# EAGLE design esp32_ornith_1.0.2 (EAGLE 9.6.2)
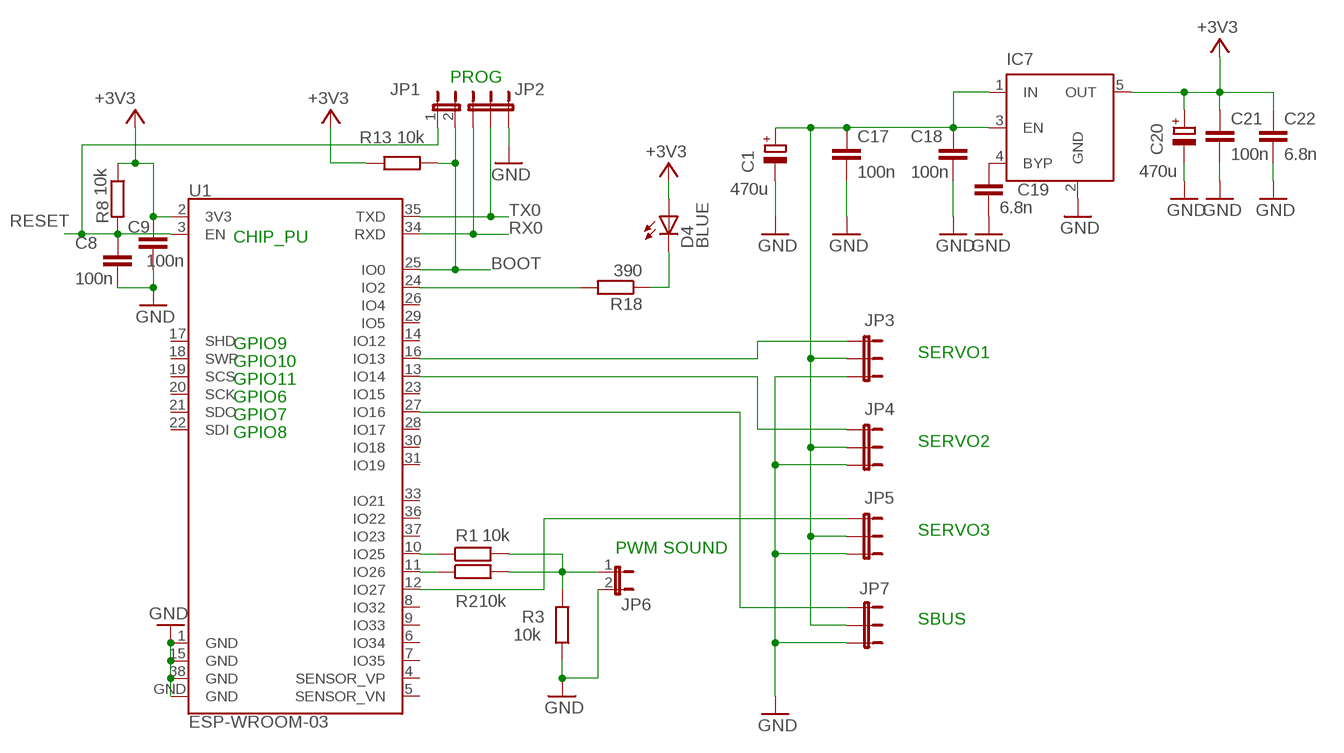
[diagram p0: schematic, sheet 1]

## Parts
C1  470u  CPOL-EUSMCD  [SMC_D]
C8  100n  C-EUC0603  [C0603]
C9  100n  C-EUC0603  [C0603]
C17  100n  C-EUC0603K  [C0603K]
C18  100n  C-EUC0603K  [C0603K]
C19  6.8n  C-EUC0603K  [C0603K]
C20  470u  CPOL-EUSMCD  [SMC_D]
C21  100n  C-EUC0603K  [C0603K]
C22  6.8n  C-EUC0603K  [C0603K]
D4  BLUE  LED-BLUE0603  [LED-0603]
IC7  MIC5219XX  [SOT23-5]
JP1  JUMPER-2PTH  [1X02]
JP2  JUMPER-3PTH  [1X03]
JP3  JUMPER-3PTH  [1X03]
JP4  JUMPER-3PTH  [1X03]
JP5  JUMPER-3PTH  [1X03]
JP6  JUMPER-2PTH  [1X02]
JP7  JUMPER-3PTH  [1X03]
R1  10k  R-EU_R0603  [R0603]
R2  10k  R-EU_R0603  [R0603]
R3  10k  R-EU_R0603  [R0603]
R8  10k  R-EU_R0603  [R0603]
R13  10k  R-EU_R0603  [R0603]
R18  390  R-EU_R0603  [R0603]
U1  ESP-WROOM-03  [ESP-WROOM-03]

## Nets
+3V3: C9.1 C20.+ C21.1 C22.1 D4.A IC7.5(OUT) R8.1 R13.2 U1.2(3V3)
+4,2V: C1.+ C17.1 C18.1 IC7.1(IN) IC7.3(EN) JP3.2 JP4.2 JP5.2 JP7.2
BOOT: JP1.2 R13.1 U1.25(IO0)
GND: C1.- C8.2 C9.2 C17.2 C18.2 C19.2 C20.- C21.2 C22.2 IC7.2(GND) JP2.3 JP3.1 JP4.1 JP5.1 JP6.2 JP7.3 R3.1 U1.1(GND) U1.15(GND) U1.38(GND) U1.GND
LED: R18.2 U1.24(IO2)
N$1: JP3.3 U1.16(IO13)
N$2: JP7.1 U1.27(IO16)
N$3: JP6.1 R1.2 R2.2 R3.2
N$4: R1.1 U1.10(IO25)
N$5: R2.1 U1.11(IO26)
N$6: D4.C R18.1
N$7: JP4.3 U1.13(IO14)
N$8: JP5.3 U1.12(IO27)
N$99: C19.1 IC7.4(BYP)
RESET: C8.1 JP1.1 R8.2 U1.3(EN)
RX0: JP2.1 U1.34(RXD)
TX0: JP2.2 U1.35(TXD)
Unconnected: U1.4(SENSOR_VP) U1.5(SENSOR_VN) U1.6(IO34) U1.7(IO35) U1.8(IO32) U1.9(IO33) U1.14(IO12) U1.17(SHD) U1.18(SWP) U1.19(SCS) U1.20(SCK) U1.21(SDO) U1.22(SDI) U1.23(IO15) U1.26(IO4) U1.28(IO17) U1.29(IO5) U1.30(IO18) U1.31(IO19) U1.33(IO21) U1.36(IO22) U1.37(IO23)

## Notes on the sheet
- PROG
- CHIP_PU
- GPIO9
- SERVO1
- GPIO10
- GPIO11
- GPIO6
- GPIO7
- GPIO8
- SERVO2
- SERVO3
- PWM SOUND
- SBUS

## Library data of the parts
C1 C20 = rcl:CPOL-EU: POLARIZED CAPACITOR, European symbol; SPICEPREFIX: C
C8 C9 C17-C19 C21 C22 = resistor:C-EU: CAPACITOR, European symbol
D4 = SparkFun-LED:LED-BLUE: Blue LEDs for production use Various blue LEDs stocked by SparkFun production 0603 - DIO-08575 Rebel - DIO-09553 1206 - DIO-09911; PROD_ID: DIO-08575
IC7 = v-reg-micrel:MIC5219XX: VOLTAGE REGULATOR; OC_FARNELL: unknown; OC_NEWARK: unknown
JP1 JP6 = SparkFun-Passives:JUMPER-2: Jumper Basic 0.1" spaced jumper. Use with breakaway headers.
JP2-JP5 JP7 = SparkFun-Passives:JUMPER-3
R1-R3 R8 R13 R18 = resistor:R-EU_: RESISTOR, European symbol
U1 = esp32:ESP-WROOM-03

## Board
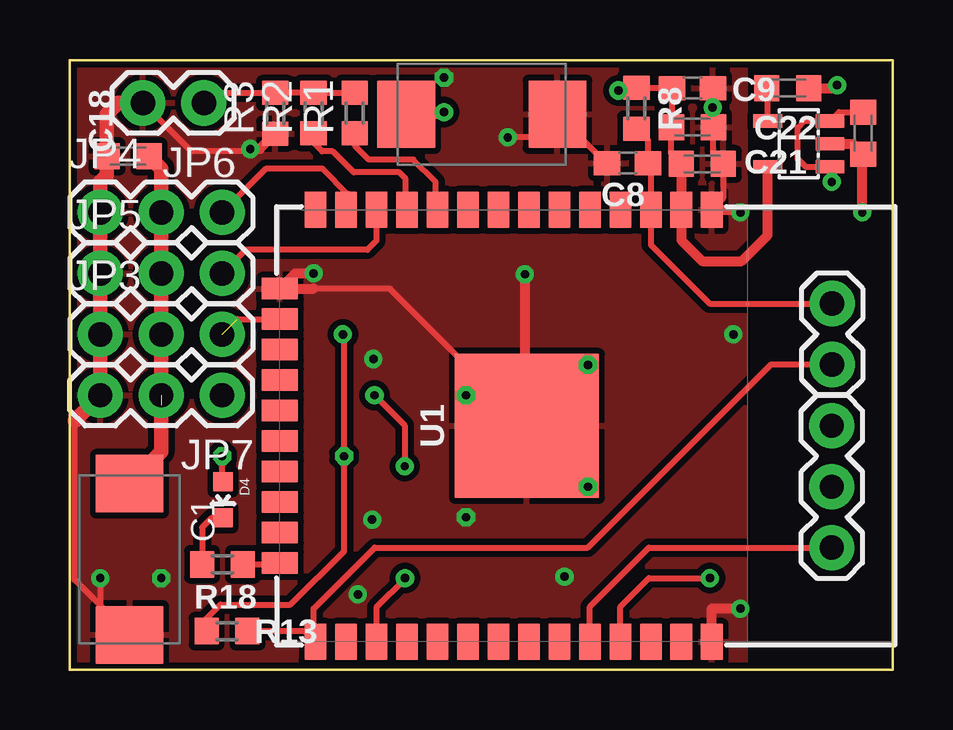
[diagram p1: board, top side]
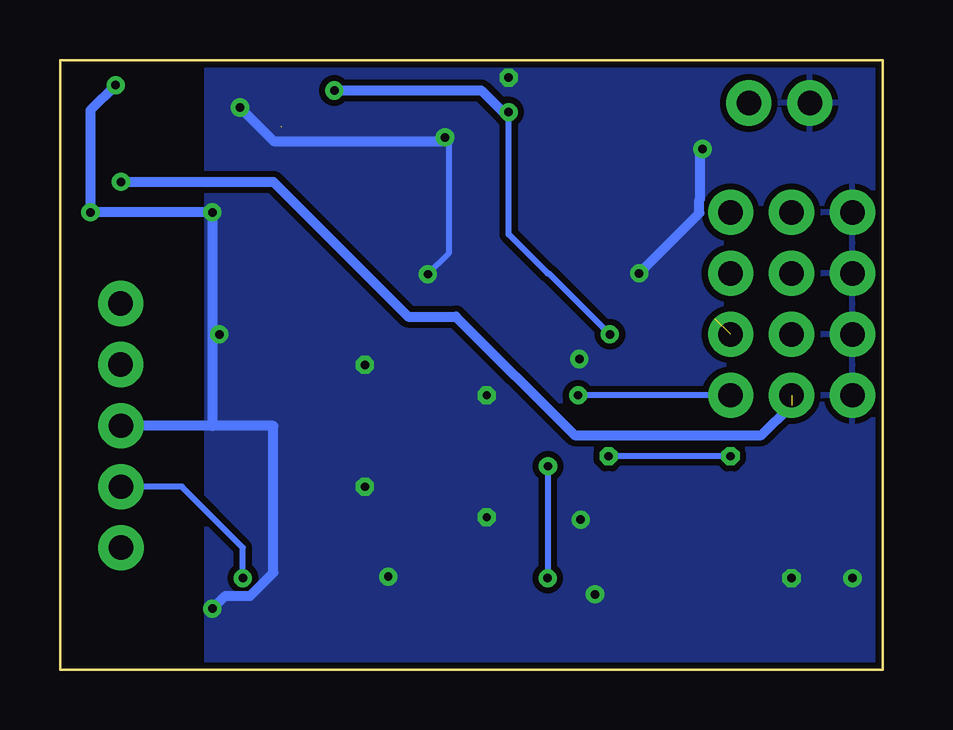
[diagram p2: board, bottom side, seen from below]

Size 34.29 x 25.4 mm. Coordinates in mm from the lower left corner, seen from the top.
Outline: 0,25.4 0,0 34.29,0 34.29,25.4 0,25.4
Copper layers (1*16): Top 0.035mm / dielectric 1.5mm / Bottom 0.035mm
Design rules "default *": minimum track width 6mil, minimum drill 0.35mm, track to track 6mil, track to pad 6mil, pad to pad 6mil, via to via 6mil, smd to smd 6mil, copper to edge 1mil, drill to drill 1mil, minimum pad ring 10mil, minimum via ring 8mil, stop-mask expansion 4mil, vias tented up to drill 15mil, thermal gap 10mil

### Footprints (pad centres in the part's own frame; a part is rotated, then mirrored left to right if it is on the bottom)
SMC_D = smd 2.4 x 2.8: + -3.15,0; - 3.15,0
C0603 = smd 1.1 x 1: 1 -0.85,0; 2 0.85,0
C0603K = smd 1.05 x 1.08: 1 -0.875,0; 2 0.875,0
LED-0603 = smd 0.8 x 0.8: A 0,-0.75; C 0,0.75
SOT23-5 = smd 0.55 x 1.2: 1 -0.95,-1.3; 2 0,-1.3; 3 0.95,-1.3; 4 0.95,1.3; 5 -0.95,1.3
1X02 = drill 1.016 pad 1.88: 1 0,0; 2 2.54,0
1X03 = drill 1.016 pad 1.88: 1 0,0; 2 2.54,0; 3 5.08,0
R0603 = smd 1 x 1.1: 1 -0.85,0; 2 0.85,0
ESP-WROOM-03 = smd 0.9 x 1.5: 1 7.7,9; 2 6.43,9; 3 5.16,9; 4 3.89,9; 5 2.62,9; 6 1.35,9; 7 0.08,9; 8 -1.19,9; 9 -2.46,9; 10 -3.73,9; 11 -5,9; 12 -6.27,9; 13 -7.54,9; 14 -8.81,9; 25 -8.81,-9; 26 -7.54,-9; 27 -6.27,-9; 28 -5,-9; 29 -3.73,-9; 30 -2.46,-9; 31 -1.19,-9; 32 0.08,-9; 33 1.35,-9; 34 2.62,-9; 35 3.89,-9; 36 5.16,-9; 37 6.43,-9; 38 7.7,-9 | smd 1.5 x 0.9: 15 -10.3,5.715; 16 -10.3,4.445; 17 -10.3,3.175; 18 -10.3,1.905; 19 -10.3,0.635; 20 -10.3,-0.635; 21 -10.3,-1.905; 22 -10.3,-3.175; 23 -10.3,-4.445; 24 -10.3,-5.715 | smd 6 x 6: GND 0,0

### Placement (x,y rotation side)
C1  2.49,4.6 270 top
C8  23.24,21.11 180 top
C9  25.95,24.23 0 top
C17  33.06,22.35 270 top
C18  2.43,21.39 180 top
C19  29.92,24.23 0 top
C20  17.17,23.14 0 top
C21  26.35,21.07 0 top
C22  25.95,22.61 0 top
D4  6.39,7.07 180 top
IC7  30.38,21.91 90 top
JP1  31.76,15.25 270 top
JP2  31.75,5.08 90 top
JP3  1.27,13.97 0 top
JP4  1.27,19.05 0 top
JP5  1.27,16.51 0 top
JP6  5.59,23.61 180 top
JP7  6.35,11.43 180 top
R1  11.87,23.19 90 top
R2  10.16,23.19 90 top
R3  8.56,23.18 90 top
R8  23.61,23.39 270 top
R13  6.55,1.6 180 top
R18  6.36,4.38 0 top
U1  19.05,10.16 0 top

### Tracks (layer width: path | path; a pad name or v marks a point on that pad's centre or on a via)
+3V3  (via drill 0.35)  (1 unrouted)
  Top 0.254: U1.2 | 25.1,22.63 C9.1 23.62,24.23 R8.1 | R13.2 5.46,1.84 5.46,1.89 6.27,2.71 9.2,2.71 11.43,4.94 v11.43,8.89 11.43,13.97 v11.38,13.97 | D4.A 6.35,7.82 v6.35,8.89 | C21.1 25.07,21.48 C22.1
  Top 0.406: U1.2 25.48,19.05 | 25.48,19.05 25.48,17.89 26.35,17.02 27.99,17.02 29.08,18.11 IC7.5 | R8.1 23.5,24.13 v22.86,24.13 | C21.1 25.48,19.05 | v15.6,23.23 15.51,23.14 C20.+
  Bottom 0.254: v11.38,13.97 13.92,16.51 13.97,16.51 15.6,18.14 15.6,23.09 | v6.35,8.89 v11.43,8.89
  Bottom 0.406: v22.86,24.13 16.74,24.13 15.7,23.09 15.6,23.09 v15.6,23.23
+4,2V  (via drill 0.35)  (1 unrouted)
  Top 0.254: C17.1 32.05,23.23 IC7.3 30.61,22.86 30.33,22.58 30.33,21.29 30.66,20.96 IC7.1 | 3.81,9.42 3.81,9.07
  Top 0.406: IC7.1 31.75,20.89 v31.75,20.32
  Top 0.61: C1.+ 3.81,9.07 JP7.2 JP3.2 JP5.2 JP4.2 3.81,20.88 C18.1
  Bottom 0.406: v31.75,20.32 25.4,20.32 19.79,14.71 17.79,14.71 12.85,9.77 5.07,9.77 3.81,11.02
BOOT
  Top 0.254: R13.1 9.8,1.6 U1.25 10.16,1.24 10.16,2.54 12.7,5.08 21.59,5.08 29.22,12.71 JP1.2
GND  (via drill 0.35)
  Top 0.254: 26.8,24.13 C9.2 | C22.2 26.82,21.48 C21.2 27.23,19.64 U1.1 | C8.2 22.35,21.11 C20.- 19.35,22.17 v18.25,22.17 | v7.52,21.69 7.42,21.59 5.07,21.59 JP6.2 | v1.27,3.81 1.27,2.67 C1.- 0.2,3.73 0.2,10.36 | 10.16,15.87 13.34,15.87 17.78,11.43 18.96,11.43 v18.96,16.47
  Top 0.406: U1.1 27.66,19.16 27.77,19.05 v27.94,19.05 | v33.02,19.05 33.02,21.44 C17.2 32.63,21.91 IC7.2 | C19.2 31.76,24.23 31.93,24.4 v31.97,24.35 | v18.96,16.47 18.96,10.25 U1.GND | v27.94,2.54 26.75,2.54 U1.38 | 10.16,15.87 U1.15 9.39,16.51 v10.16,16.51 | R3.1 7.92,21.69 v7.52,21.69 | 27.07,22.86 C22.2 26.8,22.63 26.8,24.13
  Top 0.61: JP6.2 2.02,23.61 1.55,23.14 C18.2 1.55,20.6 1.27,20.32 JP4.1 JP5.1 JP3.1 JP7.3 0.2,10.36
  Bottom 0.254: v18.25,22.17 18.1,22.02 18.1,17.34 v18.96,16.47
  Bottom 0.406: v31.97,24.35 33.02,23.3 v33.02,19.05 v27.94,19.05 27.94,10.16 | 27.94,10.16 JP2.3 | v27.94,2.54 27.4,3.08 26.37,3.08 25.4,4.04 25.4,10.16 27.94,10.16 | v10.16,16.51 7.65,19.03 7.65,19.59 7.62,19.61 7.62,21.59 v7.52,21.69 | v26.79,23.42 25.39,22.02 18.1,22.02
  other vias: 16.51,6.35 21.59,7.62 21.59,12.7 16.51,11.43 3.81,3.81 15.6,24.66 12.65,12.94 12.6,6.25 12,3.14 20.61,3.87 27.65,13.97
  pour Top (isolate 0.254): 0,25.4 0,0 28.14,0 28.14,25.4
  pour Bottom (isolate 0.254): -1.27,25.4 -1.27,0 28.16,0 28.16,25.4
LED
  Top 0.254: R18.2 8.69,4.38 U1.24
N$1  (1 unrouted)
  Top 0.254: 6.98,14.61 U1.16
N$2  (via drill 0.35)
  Top 0.254: v12.7,11.43 13.96,10.17 v13.96,8.47 | v13.97,3.81 13.97,3.78 12.78,2.59 U1.27
  Bottom 0.254: JP7.1 v12.7,11.43 | v13.96,8.47 v13.97,8.47 v13.97,3.81
N$3
  Top 0.254: JP6.1 6.01,24.03 R3.2 10.15,24.03 R2.2 R1.2
N$4
  Top 0.254: U1.10 15.24,19.24 15.24,20.32 14.31,21.25 12.46,21.25 11.88,21.83 R1.1
N$5
  Top 0.254: U1.11 14,19.21 14,20.45 13.73,20.71 11.83,20.71 10.96,21.59 10.52,21.59 10.16,21.95 R2.1
N$6
  Top 0.254: R18.1 5.51,5.93 5.91,6.32 D4.C
N$7
  Top 0.254: U1.13 11.57,19.22 11.57,19.84 10.54,20.87 8.17,20.87 JP4.3
N$8
  Top 0.254: U1.12 12.78,17.87 12.4,17.49 7.33,17.49 JP5.3
N$99
  Top 0.254: IC7.4 29.08,24.2 C19.1
RESET
  Top 0.254: JP1.1 26.66,15.25 24.21,17.7 U1.3 24.21,20.99 C8.1 24.09,22.06 R8.2
RX0
  Top 0.254: U1.34 21.67,2.62 24.13,5.08 JP2.1
TX0  (via drill 0.35)
  Top 0.254: U1.35 22.94,2.62 24.13,3.81 v26.67,3.81
  Bottom 0.254: v26.67,3.81 26.67,5.08 29.21,7.62 JP2.2